# EAGLE design XBEE_Adapter (EAGLE 5.11)
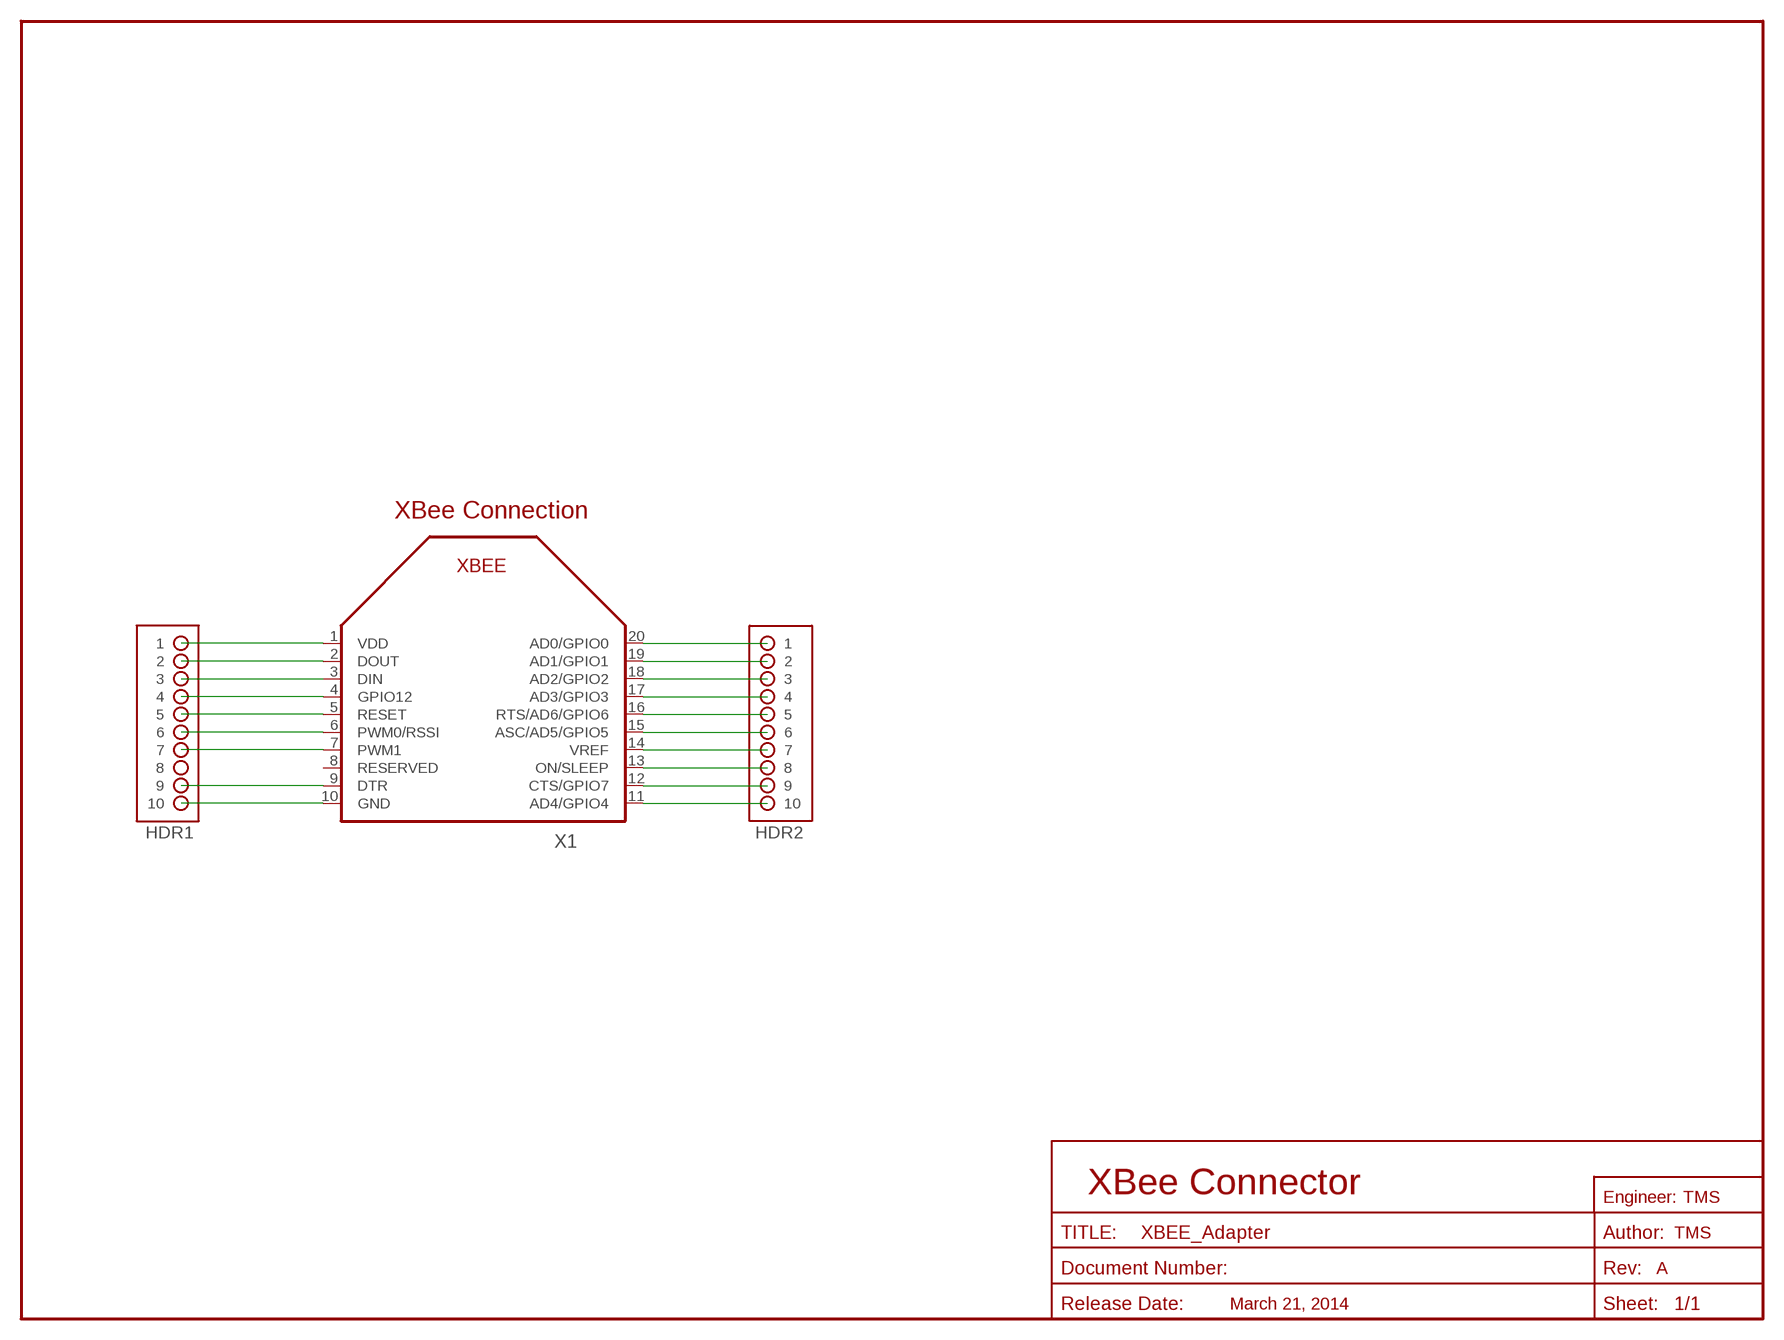
[diagram p0: schematic, sheet 1]

## Parts
HDR1  HDR-1X10  [HDR-1X10]
HDR2  HDR-1X10  [HDR-1X10]
X1  XBEE-PRO  [XBEE_CON]

## Nets
DIN: HDR1.3 X1.3(DIN)
DOUT: HDR1.2 X1.2(DOUT)
GND: HDR1.10 X1.10(GND)
N$1: HDR2.1 X1.20(AD0/GPIO0)
N$2: HDR2.2 X1.19(AD1/GPIO1)
N$3: HDR2.3 X1.18(AD2/GPIO2)
N$4: HDR2.4 X1.17(AD3/GPIO3)
N$5: HDR2.5 X1.16(RTS/AD6/GPIO6)
N$6: HDR2.6 X1.15(ASC/AD5/GPIO5)
N$7: HDR2.7 X1.14(VREF)
N$8: HDR2.8 X1.13(ON/SLEEP)
N$9: HDR2.9 X1.12(CTS/GPIO7)
N$10: HDR2.10 X1.11(AD4/GPIO4)
N$12: HDR1.9 X1.9(DTR)
N$13: HDR1.7 X1.7(PWM1)
N$14: HDR1.6 X1.6(PWM0/RSSI)
N$15: HDR1.5 X1.5(RESET)
N$16: HDR1.4 X1.4(GPIO12)
VCC: HDR1.1 X1.1(VDD)
Unconnected: HDR1.8 X1.8(RESERVED)

## Notes on the sheet
- XBee Connection
- XBee Connector
- TMS
- TMS
- A
- March 21, 2014

## Library data of the parts
HDR1 HDR2 = Mechanical:HDR-1X10
X1 = Mechanical:XBEE

## Board
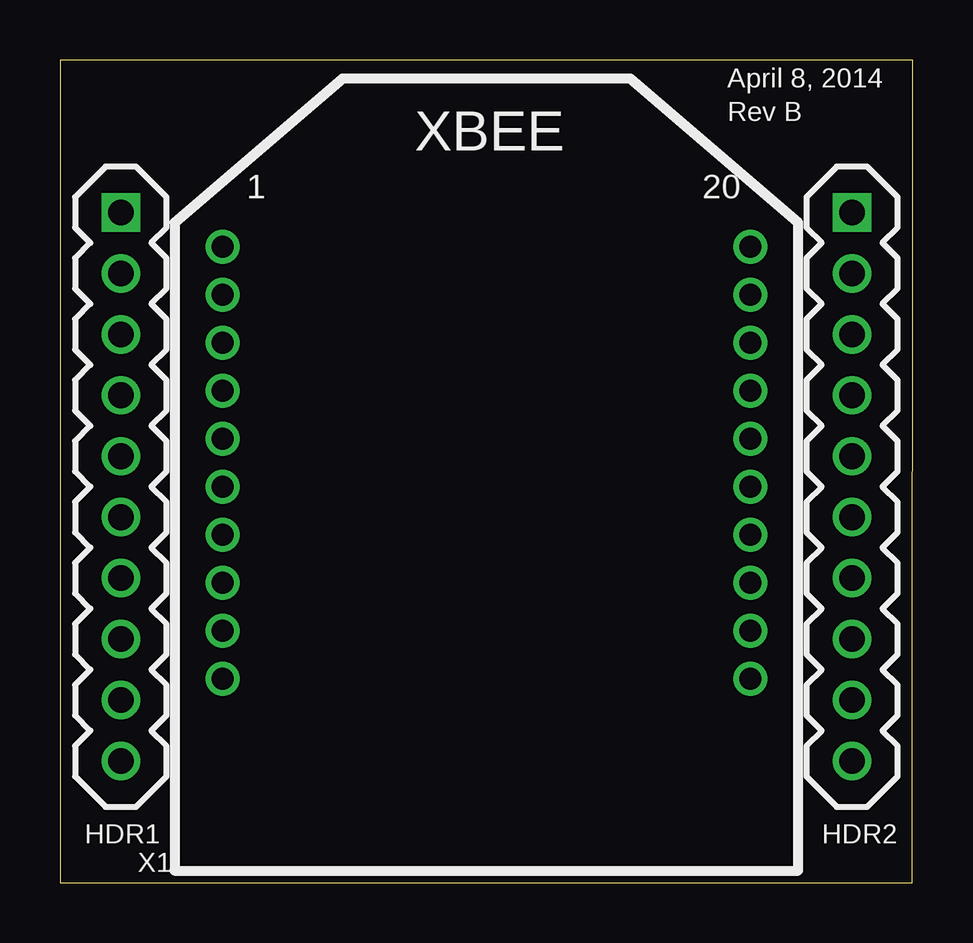
[diagram p1: board, top side]
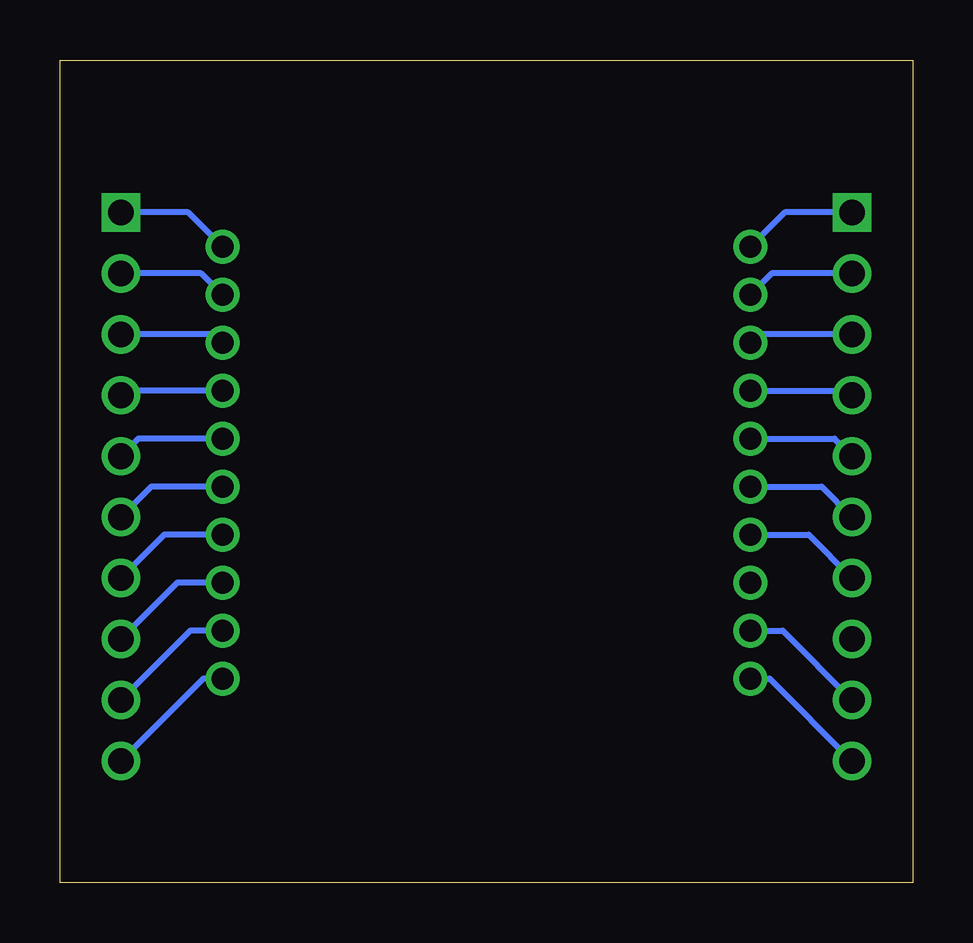
[diagram p2: board, bottom side, seen from below]

Size 35.56 x 34.29 mm. Coordinates in mm from the lower left corner, seen from the top.
Outline: 0,0 35.54,0 35.56,34.29 0,34.29 0,0
Copper layers (1*16): Top 0.035mm / dielectric 1.5mm / Bottom 0.035mm
Design rules "default *": minimum track width 10mil, minimum drill 9mil, track to track 8mil, track to pad 8mil, pad to pad 8mil, via to via 8mil, smd to smd 8mil, copper to edge 40mil, drill to drill 8mil, minimum pad ring 10mil, minimum via ring 8mil, stop-mask expansion 4mil, vias tented up to drill 0mil, thermal gap 10mil

### Footprints (pad centres in the part's own frame; a part is rotated, then mirrored left to right if it is on the bottom)
HDR-1X10 = drill 1.067 square: 1 0,0 | drill 1.067 round: 2 0,-2.54; 3 0,-5.08; 4 0,-7.62; 5 0,-10.16; 6 0,-12.7; 7 0,-15.24; 8 0,-17.78; 9 0,-20.32; 10 0,-22.86
XBEE_CON = drill 0.9 round: 1 -11,10; 2 -11,8; 3 -11,6; 4 -11,4; 5 -11,2; 6 -11,0; 7 -11,-2; 8 -11,-4; 9 -11,-6; 10 -11,-8; 11 11,-8; 12 11,-6; 13 11,-4; 14 11,-2; 15 11,0; 16 11,2; 17 11,4; 18 11,6; 19 11,8; 20 11,10

### Placement (x,y rotation side)
HDR1  2.54,27.94 0 top
HDR2  33.02,27.94 0 top
X1  17.78,16.51 0 top

### Tracks (layer width: path | path; a pad name or v marks a point on that pad's centre or on a via)
DIN
  Bottom 0.254: HDR1.3 6.43,22.86 X1.3
DOUT
  Bottom 0.254: HDR1.2 5.89,25.4 X1.2
GND
  Bottom 0.254: X1.10 5.97,8.51 HDR1.10
N$1
  Bottom 0.254: X1.20 30.21,27.94 HDR2.1
N$2
  Bottom 0.254: X1.19 29.67,25.4 HDR2.2
N$3
  Bottom 0.254: X1.18 29.13,22.86 HDR2.3
N$4
  Bottom 0.254: X1.17 32.83,20.51 HDR2.4
N$5
  Bottom 0.254: X1.16 32.29,18.51 HDR2.5
N$6
  Bottom 0.254: X1.15 31.75,16.51 HDR2.6
N$7
  Bottom 0.254: X1.14 31.21,14.51 HDR2.7
N$8
  Bottom 0.254: X1.13 30.67,12.51 HDR2.8
N$9
  Bottom 0.254: X1.12 30.13,10.51 HDR2.9
N$10
  Bottom 0.254: X1.11 29.59,8.51 HDR2.10
N$12
  Bottom 0.254: X1.9 5.43,10.51 HDR1.9
N$13
  Bottom 0.254: X1.7 4.35,14.51 HDR1.7
N$14
  Bottom 0.254: X1.6 3.81,16.51 HDR1.6
N$15
  Bottom 0.254: X1.5 3.27,18.51 HDR1.5
N$16
  Bottom 0.254: X1.4 2.73,20.51 HDR1.4
VCC
  Bottom 0.254: HDR1.1 5.35,27.94 X1.1

### Text on the board
tNames: April 8, 2014 | Rev B